# EAGLE design stepper (EAGLE 9.5.2)
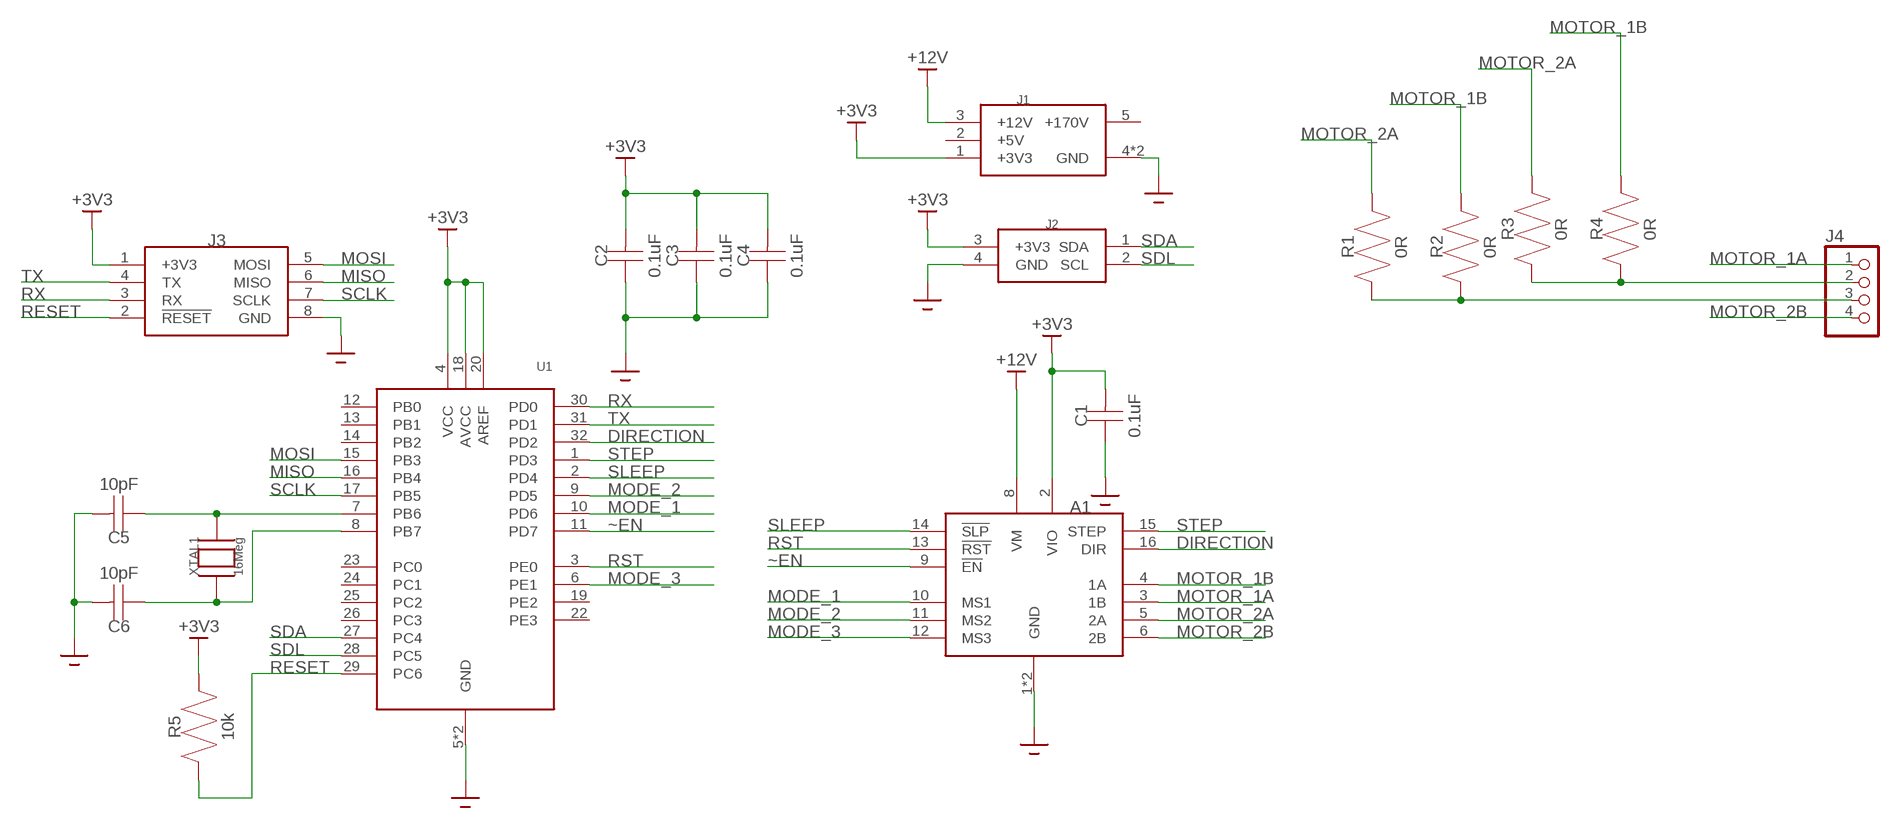
[diagram p0: schematic, sheet 1]

## Parts
A1  STEPPER_DRIVER  [STEPPER_DRIVER]
C1  0.1uF  CAPACITOR0402  [0402]
C2  0.1uF  CAPACITOR0402  [0402]
C3  0.1uF  CAPACITOR0402  [0402]
C4  0.1uF  CAPACITOR0402  [0402]
C5  10pF  CAPACITOR0402  [0402]
C6  10pF  CAPACITOR0402  [0402]
J1  1-770969-0  [1-770969-0]
J2  1-770968-0  [1-770968-0]
J3  DF1BZ-8DP-2.5DSA  [DF1BZ-8DP-2.5DSA]
J4  S4B-XH-A  [S4B-XH-A]
R1  0R  RESISTOR0402  [0402]
R2  0R  RESISTOR0402  [0402]
R3  0R  RESISTOR0402  [0402]
R4  0R  RESISTOR0402  [0402]
R5  10k  RESISTOR0402  [0402]
U1  ATMEGA328PB32-TQFP  [ATMEGA328PB]
XTAL1  16Meg  XRCGB  [XRCGB]

## Nets
+3V3: A1.2(VIO) C1.2 C2.2 C3.2 C4.2 J1.1(+3V3) J2.3(+3V3) J3.1(+3V3) R5.2 U1.4(VCC) U1.18(AVCC) U1.20(AREF)
+12V: A1.8(VM) J1.3(+12V)
DIRECTION: A1.16(DIR) U1.32(PD2)
GND: A1.1(GND) A1.7(GND) C1.1 C2.1 C3.1 C4.1 C5.2 C6.2 J1.4(GND) J1.6(GND) J2.4(GND) J3.8(GND) U1.5(GND) U1.21(GND)
MISO: J3.6(MISO) U1.16(PB4)
MODE_1: A1.10(MS1) U1.10(PD6)
MODE_2: A1.11(MS2) U1.9(PD5)
MODE_3: A1.12(MS3) U1.6(PE1)
MOSI: J3.5(MOSI) U1.15(PB3)
MOTOR_1A: A1.3(1B) J4.1
MOTOR_1B: A1.4(1A) R2.2 R4.2
MOTOR_2A: A1.5(2A) R1.2 R3.2
MOTOR_2B: A1.6(2B) J4.4
N$1: C5.1 U1.7(PB6) XTAL1.2 XTAL1.4
N$2: C6.1 U1.8(PB7) XTAL1.1 XTAL1.3
N$3: J4.2 R3.1 R4.1
N$5: J4.3 R1.1 R2.1
RESET: J3.2(!RESET) R5.1 U1.29(PC6)
RST: A1.13(!RST) U1.3(PE0)
RX: J3.3(RX) U1.30(PD0)
SCLK: J3.7(SCLK) U1.17(PB5)
SDA: J2.1(SDA) U1.27(PC4)
SDL: J2.2(SCL) U1.28(PC5)
SLEEP: A1.14(!SLP) U1.2(PD4)
STEP: A1.15(STEP) U1.1(PD3)
TX: J3.4(TX) U1.31(PD1)
~EN: A1.9(!EN) U1.11(PD7)
Unconnected: U1.12(PB0) U1.13(PB1) U1.14(PB2) U1.19(PE2) U1.22(PE3) U1.23(PC0) U1.24(PC1) U1.25(PC2) U1.26(PC3)

## Power pins joined to a net without a drawn wire
+5V: J1.2(+5V)
+170V: J1.5(+170V)

## Library data of the parts
A1 = Zach:STEPPER_DRIVER
C1-C6 = Zach:CAPACITOR
J1 = Zach:1-770969-0
J2 = Zach:1-770968-0
J3 = Zach:DF1BZ-8DP-2.5DSA
J4 = Zach:S4B-XH-A
R1-R5 = Zach:RESISTOR
U1 = Zach:ATMEGA328PB
XTAL1 = Zach:XRCGB

## Board
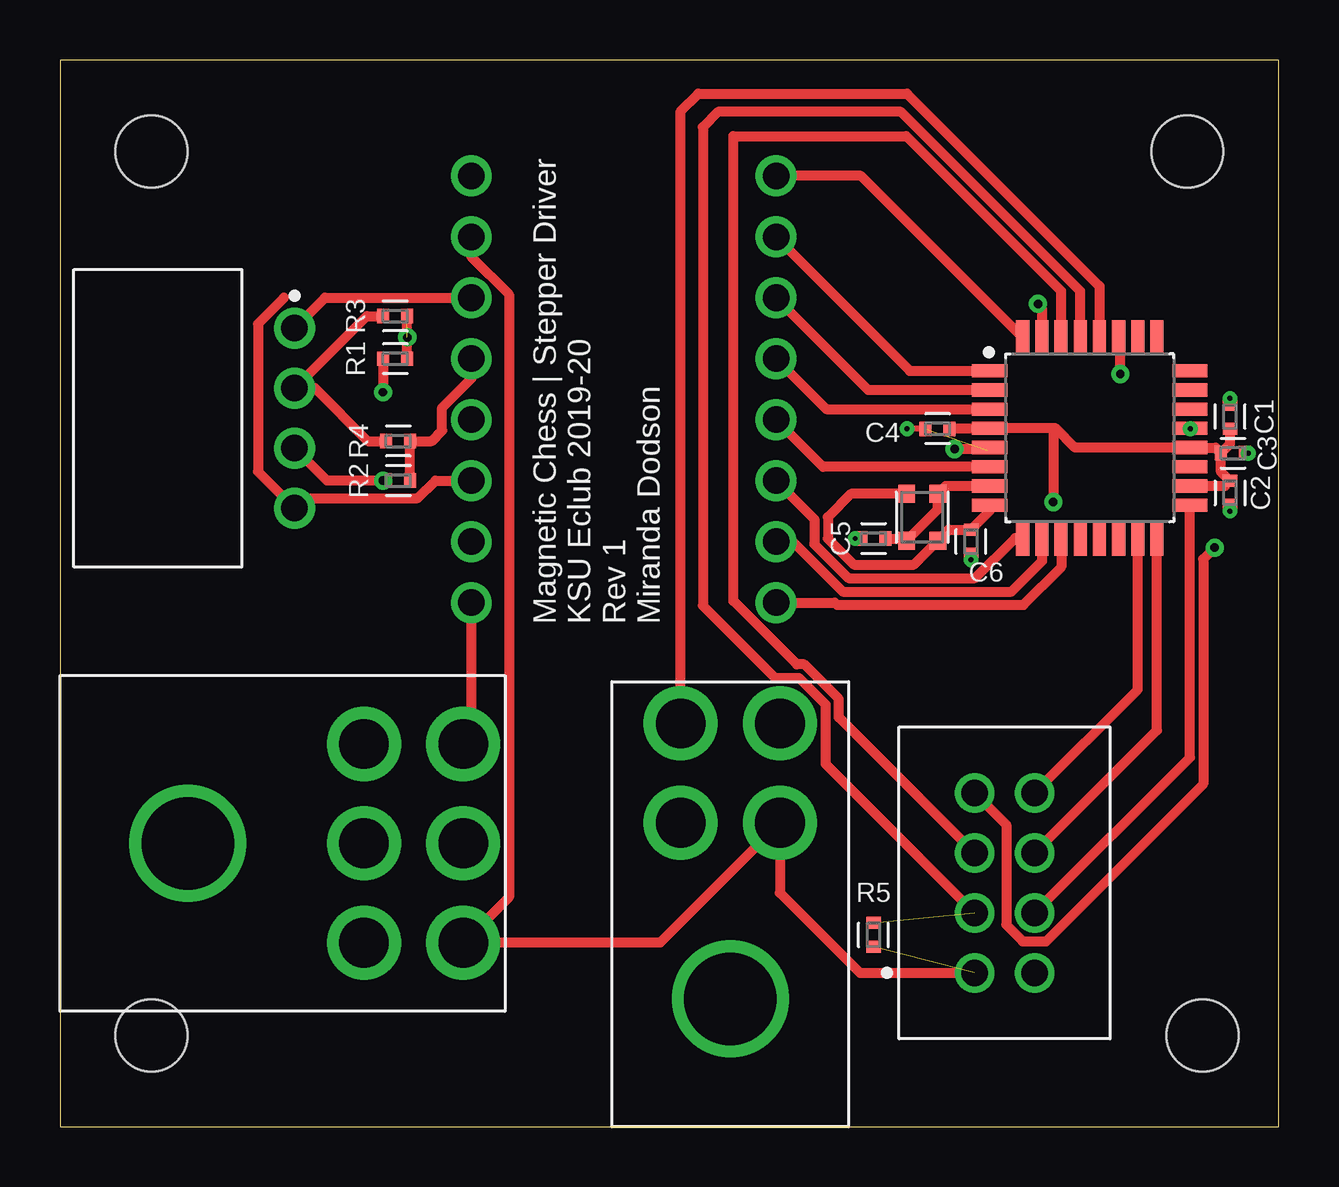
[diagram p1: board, top side]
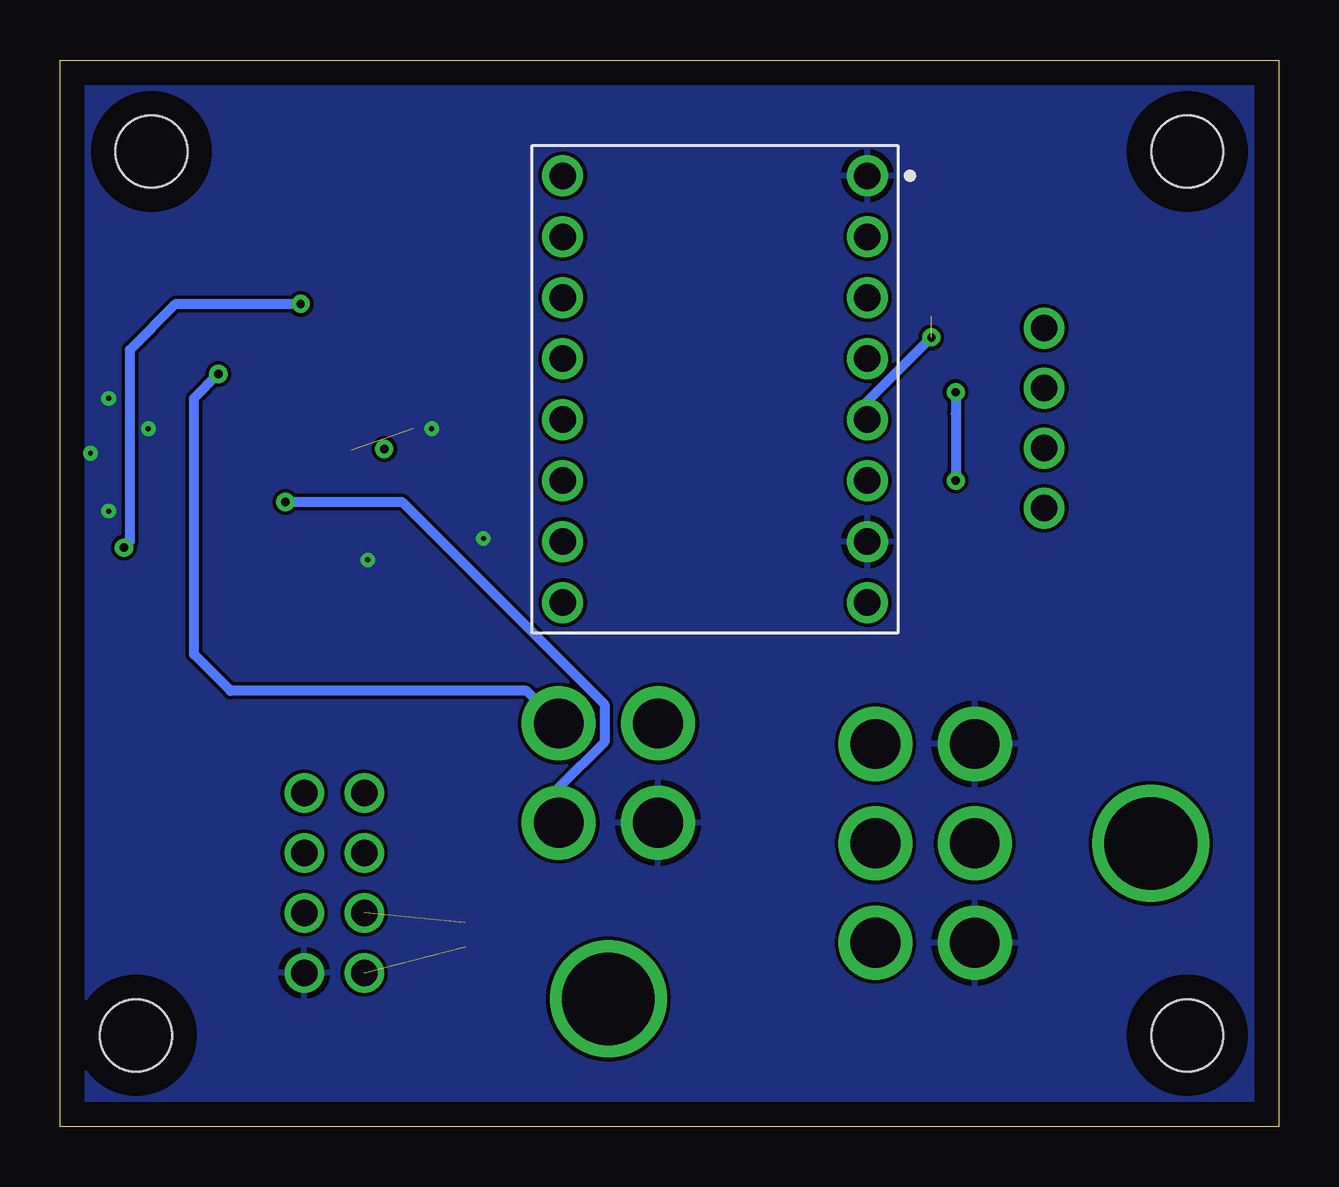
[diagram p2: board, bottom side, seen from below]

Size 50.8 x 44.45 mm. Coordinates in mm from the lower left corner, seen from the top.
Outline: 0,0 50.8,0 50.8,44.45 0,44.45 0,0
Copper layers (1*16): Top 0.035mm / dielectric 1.5mm / Bottom 0.035mm
Design rules "default": minimum track width 6mil, minimum drill 0.35mm, track to track 6mil, track to pad 6mil, pad to pad 6mil, via to via 6mil, smd to smd 6mil, copper to edge 40mil, drill to drill 6mil, minimum pad ring 10mil, minimum via ring 8mil, stop-mask expansion 4mil, vias tented up to drill 0mil, thermal gap 10mil
Holes 3 mm at 3.81,40.64 46.99,40.64 47.62,3.81 3.81,3.81

### Footprints (pad centres in the part's own frame; a part is rotated, then mirrored left to right if it is on the bottom)
STEPPER_DRIVER = drill 1.105 pad 1.705: 1 -8.89,6.35; 2 -6.35,6.35; 3 -3.81,6.35; 4 -1.27,6.35; 5 1.27,6.35; 6 3.81,6.35; 7 6.35,6.35; 8 8.89,6.35; 9 8.89,-6.35; 10 6.35,-6.35; 11 3.81,-6.35; 12 1.27,-6.35; 13 -1.27,-6.35; 14 -3.81,-6.35; 15 -6.35,-6.35; 16 -8.89,-6.35
0402 = smd 0.5 x 0.6: 1 -0.5,0; 2 0.5,0
1-770969-0 = drill 2.07: 1 4.14,16.81; 2 0,16.81; 3 -4.14,16.81; 4 4.14,12.67; 5 0,12.67; 6 -4.14,12.67 | drill 3.86: 7 0,5.33
1-770968-0 = drill 2.07: 1 2.07,16.81; 2 -2.07,16.81; 3 2.07,12.67; 4 -2.07,12.67 | drill 3.86: 5 0,5.33
DF1BZ-8DP-2.5DSA = drill 1.1: 1 -3.75,1.25; 2 -1.25,1.25; 3 1.25,1.25; 4 3.75,1.25; 5 3.75,-1.25; 6 1.25,-1.25; 7 -1.25,-1.25; 8 -3.75,-1.25
S4B-XH-A = drill 1.105 pad 1.705: 1 0,0; 2 2.5,0; 3 5,0; 4 7.5,0
ATMEGA328PB = smd 1.469 x 0.547: 1 -4.171,2.8; 2 -4.171,2; 3 -4.171,1.2; 4 -4.171,0.4; 5 -4.171,-0.4; 6 -4.171,-1.2; 7 -4.171,-2; 8 -4.171,-2.8; 17 4.171,-2.8; 18 4.171,-2; 19 4.171,-1.2; 20 4.171,-0.4; 21 4.171,0.4; 22 4.171,1.2; 23 4.171,2; 24 4.171,2.8 | smd 0.547 x 1.469: 9 -2.8,-4.171; 10 -2,-4.171; 11 -1.2,-4.171; 12 -0.4,-4.171; 13 0.4,-4.171; 14 1.2,-4.171; 15 2,-4.171; 16 2.8,-4.171; 25 2.8,4.171; 26 2,4.171; 27 1.2,4.171; 28 0.4,4.171; 29 -0.4,4.171; 30 -1.2,4.171; 31 -2,4.171; 32 -2.8,4.171
XRCGB = smd 0.75 x 0.7: 1 0.975,0.65; 2 -0.975,0.65; 3 -0.975,-0.65; 4 0.975,-0.65

### Placement (x,y rotation side)
A1  23.5,30.73 270 bottom
C1  48.77,29.59 270 top
C2  48.77,26.42 90 top
C3  48.9,28.07 180 top
C4  36.58,29.08 0 top
C5  33.91,24.51 180 top
C6  37.97,24.38 270 top
J1  0,11.81 270 top
J2  27.94,0 0 top
J3  39.37,10.16 90 top
J4  9.78,33.27 270 top
R1  13.97,32 0 top
R2  14.1,26.92 0 top
R3  13.97,33.78 0 top
R4  14.1,28.57 0 top
R5  33.91,8 270 top
U1  42.93,28.7 0 top
XTAL1  35.94,25.4 90 top

### Tracks (layer width: path | path; a pad name or v marks a point on that pad's centre or on a via)
+3V3  (via drill 0.35)  (1 unrouted)
  Top 0.406: C4.2 37.37,29.1 U1.4 41.51,29.1 | C3.2 48.16,28.3 U1.20 42.31,28.3 41.51,29.1 | C1.2 48.77,28.44 C3.2 | C3.2 48.4,27.29 C2.2 48.55,26.7 U1.18 | J3.1 33.35,6.41 30.01,9.75 J2.3 25.01,7.67 J1.1 18.71,9.57 18.71,34.69 17.14,36.25 A1.2 | 41.51,29.1 41.4,28.99 v41.4,26.04
  Bottom 0.406: v41.4,26.04 36.55,26.04 28.11,17.6 28.11,16.02 30.01,14.12 J2.3
+12V
  Top 0.406: A1.8 17.14,16.29 J1.3
DIRECTION
  Top 0.406: U1.32 33.38,39.62 A1.16
GND  (via drill 0.2 pad 0.25)  (1 unrouted)
  Top 0.152: U1.21 v47.12,29.08
  Top 0.254: v49.53,28.07 C3.1 | v48.77,25.65 C2.1 | C5.2 v33.15,24.51 | C6.2 v37.97,23.62 | C4.1 36.06,29.08 v35.31,29.08 | U1.5 38.65,28.19 | C1.1 v48.77,30.35
  pour Bottom: 50.67,44.2 0.13,44.2 0.13,0.13 50.67,0.13
MISO
  Top 0.406: J3.6 45.73,16.52 U1.16
MODE_1
  Top 0.406: A1.10 30.55,24.38 32.63,22.3 39.66,22.3 40.93,23.57 U1.10
MODE_2
  Top 0.406: A1.11 31.45,25.32 31.45,24.28 32.87,22.86 38.15,22.86 39.82,24.53 U1.9
MODE_3
  Top 0.406: U1.6 31.81,27.5 A1.12
MOSI
  Top 0.406: J3.5 44.93,18.22 U1.15
MOTOR_1A
  Top 0.406: J4.1 11.05,34.54 A1.3
MOTOR_1B
  Top 0.406: R2.2 R4.2 15.49,28.57 15.94,29.02 15.94,29.96 17.14,31.17 A1.4
MOTOR_2A  (via drill 0.35)  (1 unrouted)
  Top 0.406: R1.2 R3.2
  Bottom 0.406: v14.48,32.89 17.14,30.23 A1.5
MOTOR_2B
  Top 0.406: 9.34,34.54 8.26,33.46 8.26,27.3 J4.4 10.2,26.19 14.92,26.19 15.65,26.92 A1.6
N$1
  Top 0.406: U1.7 36.92,26.7 XTAL1.4 36.59,25.73 XTAL1.2 35.2,24.51 C5.1
N$2
  Top 0.406: U1.8 38.76,25.67 C6.1 37.05,24.88 XTAL1.3 35.59,23.42 33.1,23.42 32,24.51 32,25.4 32.98,26.38 XTAL1.1
N$3
  Top 0.406: R3.1 12.79,33.78 J4.2 10.63,30.77 12.83,28.57 R4.1
N$4  (via drill 0.35)
  Top 0.406: v37.29,28.25 38.05,28.25
N$5  (via drill 0.35 pad 0.25)
  Top 0.254: v13.47,30.61 v13.46,30.61
  Top 0.406: R2.1 v13.46,26.92 11.13,26.92 J4.3 | R1.1 v13.47,30.61
  Bottom 0.406: v13.46,30.61 13.46,29.72 v13.46,26.92
RESET  (1 unrouted)
  Top 0.406: U1.29 42.53,34.82 35.05,42.29 27.43,42.29 26.8,41.66 26.8,21.72 29.8,18.71 30.8,18.71 31.91,17.6 31.91,15.12 J3.2
RST
  Top 0.406: A1.13 31.95,29.9 U1.3
RX
  Top 0.406: J3.3 32.47,17.06 32.47,17.83 31.03,19.27 30.71,19.27 28.07,21.91 28.07,41.27 35.28,41.27 41.73,34.83 U1.30
SCLK
  Top 0.406: J3.7 47.1,15.39 U1.17
SDA  (via drill 0.35)
  Top 0.406: v44.2,31.37 44.2,32.8 U1.27
  Bottom 0.406: J2.1 31.36,18.16 43.69,18.16 45.21,19.68 45.21,30.35 v44.2,31.37
SDL
  Top 0.406: J2.2 25.87,42.31 26.61,43.05 35.31,43.05 43.33,35.03 U1.28
SLEEP
  Top 0.406: A1.14 33.69,30.7 U1.2
STEP
  Top 0.406: A1.15 35.43,31.5 U1.1
TX  (via drill 0.35)
  Top 0.406: J3.4 39.44,12.59 39.44,8.42 40.13,7.73 41.11,7.73 47.66,14.28 47.66,23.65 v48.13,24.13 | v40.77,34.29 40.93,34.13 U1.31
  Bottom 0.406: v48.13,24.13 47.88,24.38 47.88,32.38 45.97,34.29 v40.77,34.29
~EN
  Top 0.406: A1.9 32.3,21.84 32.4,21.74 40.16,21.74 41.73,23.32 U1.11

### Text on the board
tPlace: Magnetic Chess | Stepper Driver / KSU Eclub 2019-20 / Rev 1 / Miranda Dodson